# Altium schematic sheet ISO_Transformer.SchDoc: Isolation
size A; Organization: Cal Poly Racing; engineer1: Graydon Wilson; engineer2: Jason Childers; engineer3: Haley Pierce
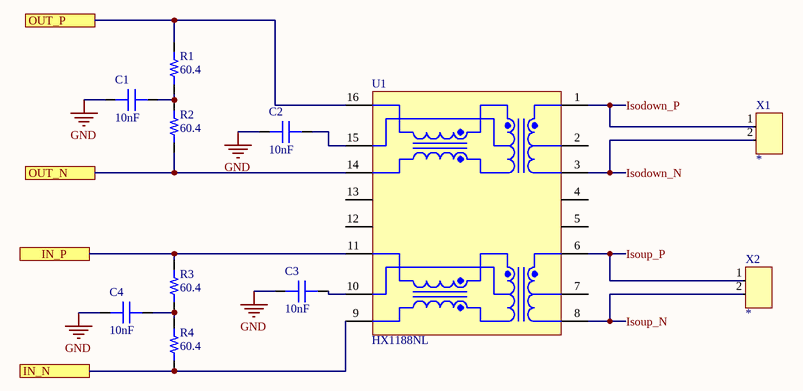
[diagram p0: ISO_Transformer.SchDoc]

## Parts
C1  capacitance: 10nF  [0603]  (hidden comment: capacitor)
C2  capacitance: 10nF  [0603]  (hidden comment: capacitor)
C3  capacitance: 10nF  [0603]  (hidden comment: capacitor)
C4  capacitance: 10nF  [0603]  (hidden comment: capacitor)
R1  60.4  [RES 0603/1608]
R2  60.4  [RES 0603/1608]
R3  60.4  [RES 0603/1608]
R4  60.4  [RES 0603/1608]
U1  HX1188NL  [PULS-MODULE-16_V]
X1  *  [CONN 43650-0200 MOLEX 2PIN]
X2  *  [CONN 43650-0200 MOLEX 2PIN]

## Ports
IN_N, IN_P, OUT_N, OUT_P

## Nets
GND: C1.1 C2.1 C3.1 C4.1
IN_N: R4.1 U1.9 ; port IN_N
IN_P: R3.2 U1.11 ; port IN_P
Isodown_N: U1.3 X1.2
Isodown_P: U1.1 X1.1
Isoup_N: U1.8 X2.2
Isoup_P: U1.6 X2.1
OUT_N: R2.1 U1.14 ; port OUT_N
OUT_P: R1.2 U1.16 ; port OUT_P
NetC1_2: C1.2 R1.1 R2.2
NetC2_2: C2.2 U1.15
NetC3_2: C3.2 U1.10
NetC4_2: C4.2 R3.1 R4.2

Not connected (* = marked no-connect by the designer): U1 2 4 5 7 12 13

## Notes on the sheet
- Date:
- Time:
- File:

## Library data of the parts
C1-C4 = 1: Generic 0603 capacitor; id: 1; voltage: 50; dielectric: Ceramic; percent tolerance: 10; name: 0603 Capacitor; ESR: 1; package: 0603; quantity: 0
R1-R4 = 1: id: 1; name: 0603 Resistor; percent tolerance: 5; resistance: 60.4; package: 0603; quantity: 0
U1 = CMP-2000-05323-1: 10/100 Base-T Single Port Surface Mount Magnetic with Turns Ratio, -40 to 85 degC, 16-Pin Module, RoHS, Tube; Manufacturer: Pulse Electronics; Other Related Documents: PackagesFNLvs.NL; Other Names: 553-1340; PCN Design/Specification: ThermoplasticHeaderDesign28/Jun/2013; Transformer Type: IsolationandDataInterface(Encapsulated); PCN Other: HaloInjunctionRes1/Sep/2015; Turns Ratio - Primary: Secondary:1:1Transmitter,1:1Receiver; Family: PulseTransformers; Datasheet URL: https://datasheet.ciiva.com/26929/hx1188nl-26929858.pdf; Mounting Type: SurfaceMount; Size / Dimension: 12.70mmLx7.11mmW; Inductance: -; Package Description: 16-Pin Surface Mount Device, Body 12.7 x 7.11 mm, Pitch 1.27 mm; Height - Seated (Max): 6.22mm; E.T.: -; Online Catalog: 10/100BASE-TSinglePort; Manufacturer URL: http://www.pulseelectronics.com/; Package Reference: MODULE-16; Series: -; Category: Transformers; Standard Package: 40; Datasheet Version: Rev. H325.Q, 09/2009
X1 X2 = 9: Molex 43650_0200; id: 9; name: 0436500200; numcontacts: 2; numrows: 1; pitch: 3 mm; MfrPartNo: *; quantity: 0; link: https://www.digikey.com/product-detail/en/molex-llc/0436500200/WM1860-ND/268989